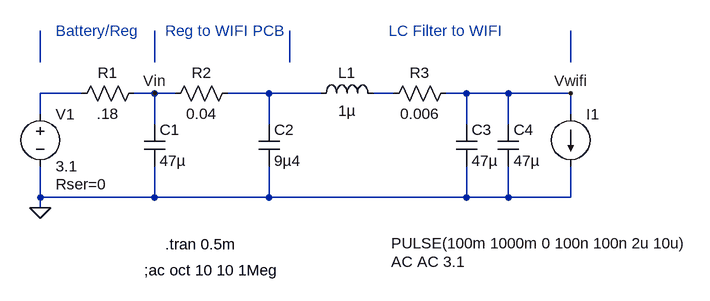
[diagram p0: schematic LC Filter.asc]
LC Filter.asc, the LTspice schematic file:
Version 4
SHEET 1 920 680
WIRE -288 96 -288 48
WIRE -112 96 -112 48
WIRE 96 96 96 48
WIRE 528 96 528 48
WIRE -224 144 -288 144
WIRE -112 144 -144 144
WIRE -80 144 -112 144
WIRE 64 144 0 144
WIRE 144 144 64 144
WIRE 256 144 224 144
WIRE 368 144 336 144
WIRE 432 144 368 144
WIRE 528 144 432 144
WIRE -288 176 -288 144
WIRE 528 176 528 144
WIRE -112 192 -112 144
WIRE 64 192 64 144
WIRE 368 192 368 144
WIRE 432 192 432 144
WIRE -288 304 -288 256
WIRE -112 304 -112 256
WIRE -112 304 -288 304
WIRE 64 304 64 256
WIRE 64 304 -112 304
WIRE 368 304 368 256
WIRE 368 304 64 304
WIRE 432 304 432 256
WIRE 432 304 368 304
WIRE 528 304 528 256
WIRE 528 304 432 304
WIRE -288 320 -288 304
FLAG -288 320 0
FLAG 528 144 Vwifi
FLAG -112 144 Vin
SYMBOL ind 128 160 R270
WINDOW 0 32 56 VTop 2
WINDOW 3 5 56 VBottom 2
SYMATTR InstName L1
SYMATTR Value 1µ
SYMATTR SpiceLine Ipk=1550m Rser=0.034
SYMBOL cap -128 192 R0
SYMATTR InstName C1
SYMATTR Value 47µ
SYMATTR SpiceLine V=6.3 Rser=10M
SYMBOL cap 48 192 R0
SYMATTR InstName C2
SYMATTR Value 9µ4
SYMATTR SpiceLine V=6.3 Rser=10M
SYMBOL voltage -288 160 R0
WINDOW 123 0 0 Left 2
WINDOW 39 24 124 Left 2
SYMATTR SpiceLine Rser=0
SYMATTR InstName V1
SYMATTR Value 3.1
SYMBOL load2 528 176 R0
WINDOW 3 -276 199 Left 2
WINDOW 123 -276 227 Left 2
WINDOW 39 -188 203 Left 2
SYMATTR Value PULSE(100m 1000m 0 100n 100n 2u 10u)
SYMATTR Value2 AC AC 3.1
SYMATTR InstName I1
SYMBOL cap 352 192 R0
SYMATTR InstName C3
SYMATTR Value 47µ
SYMATTR SpiceLine V=6.3 Rser=10M
SYMBOL res -128 128 R90
WINDOW 0 0 56 VBottom 2
WINDOW 3 32 56 VTop 2
SYMATTR InstName R1
SYMATTR Value .18
SYMBOL res 16 128 R90
WINDOW 0 0 56 VBottom 2
WINDOW 3 32 56 VTop 2
SYMATTR InstName R2
SYMATTR Value 0.04
SYMBOL cap 416 192 R0
SYMATTR InstName C4
SYMATTR Value 47µ
SYMATTR SpiceLine Rser=10M
SYMBOL res 352 128 R90
WINDOW 0 0 56 VBottom 2
WINDOW 3 32 56 VTop 2
SYMATTR InstName R3
SYMATTR Value 0.006
TEXT -96 376 Left 2 !.tran 0.5m
TEXT 248 48 Left 2 ;LC Filter to WIFI
TEXT -128 416 Left 2 !;ac oct 10 10 1Meg
TEXT -264 48 Left 2 ;Battery/Reg
TEXT -96 48 Left 2 ;Reg to WIFI PCB

The netlist it stands for:
* LC Filter.asc
L1 N006 N007 1µ Ipk=1550m Rser=0.034
C1 Vin 0 47µ V=6.3 Rser=10M
C2 N006 0 9µ4 V=6.3 Rser=10M
V1 N005 0 3.1 Rser=0
I1 Vwifi 0 PULSE(100m 1000m 0 100n 100n 2u 10u) AC AC 3.1
C3 Vwifi 0 47µ V=6.3 Rser=10M
R1 Vin N005 .18
R2 N006 Vin 0.04
C4 Vwifi 0 47µ Rser=10M
R3 Vwifi N007 0.006
.tran 0.5m
* LC Filter to WIFI
;ac oct 10 10 1Meg
* Battery/Reg
* Reg to WIFI PCB
.backanno
.end